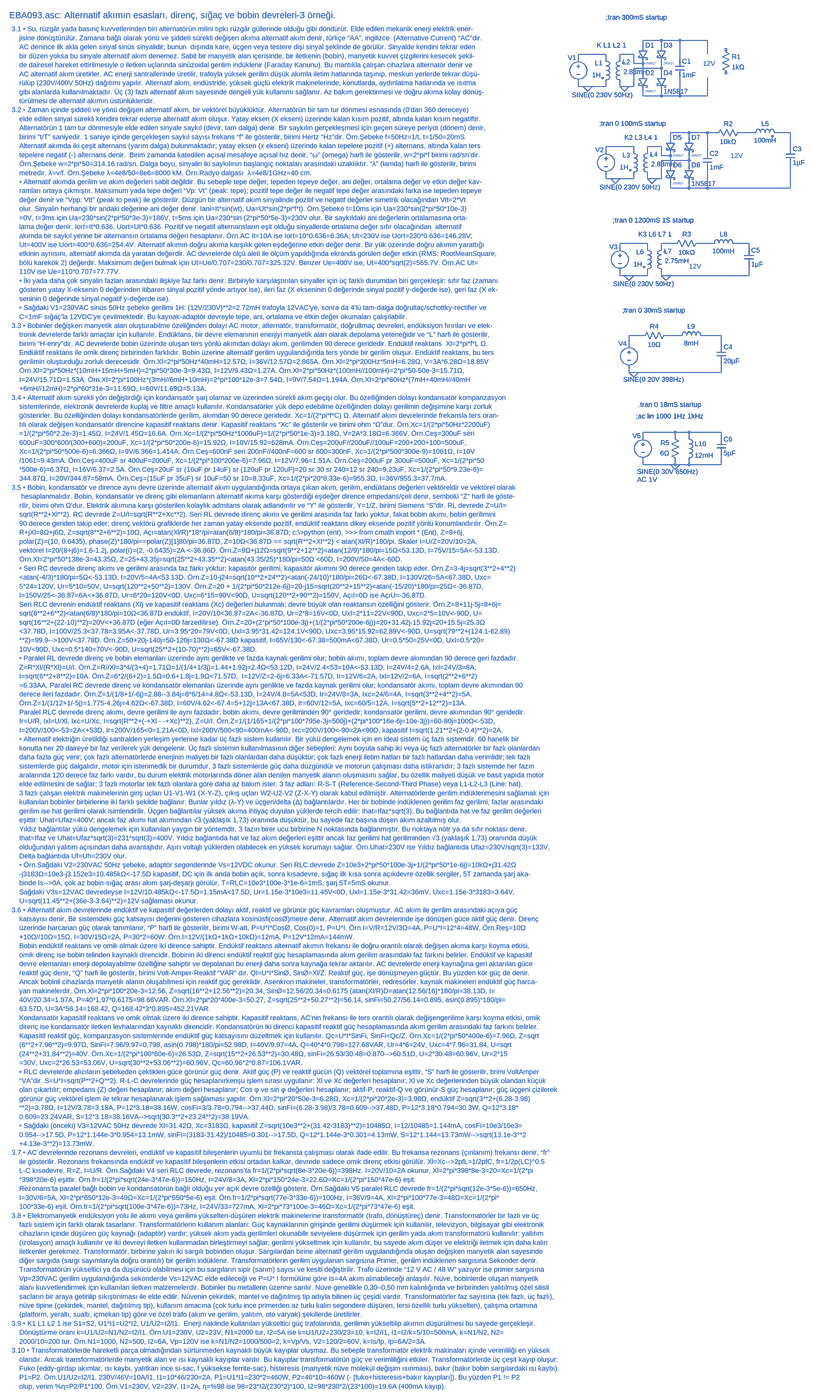
[diagram p0: schematic EBA093.asc, whole sheet]
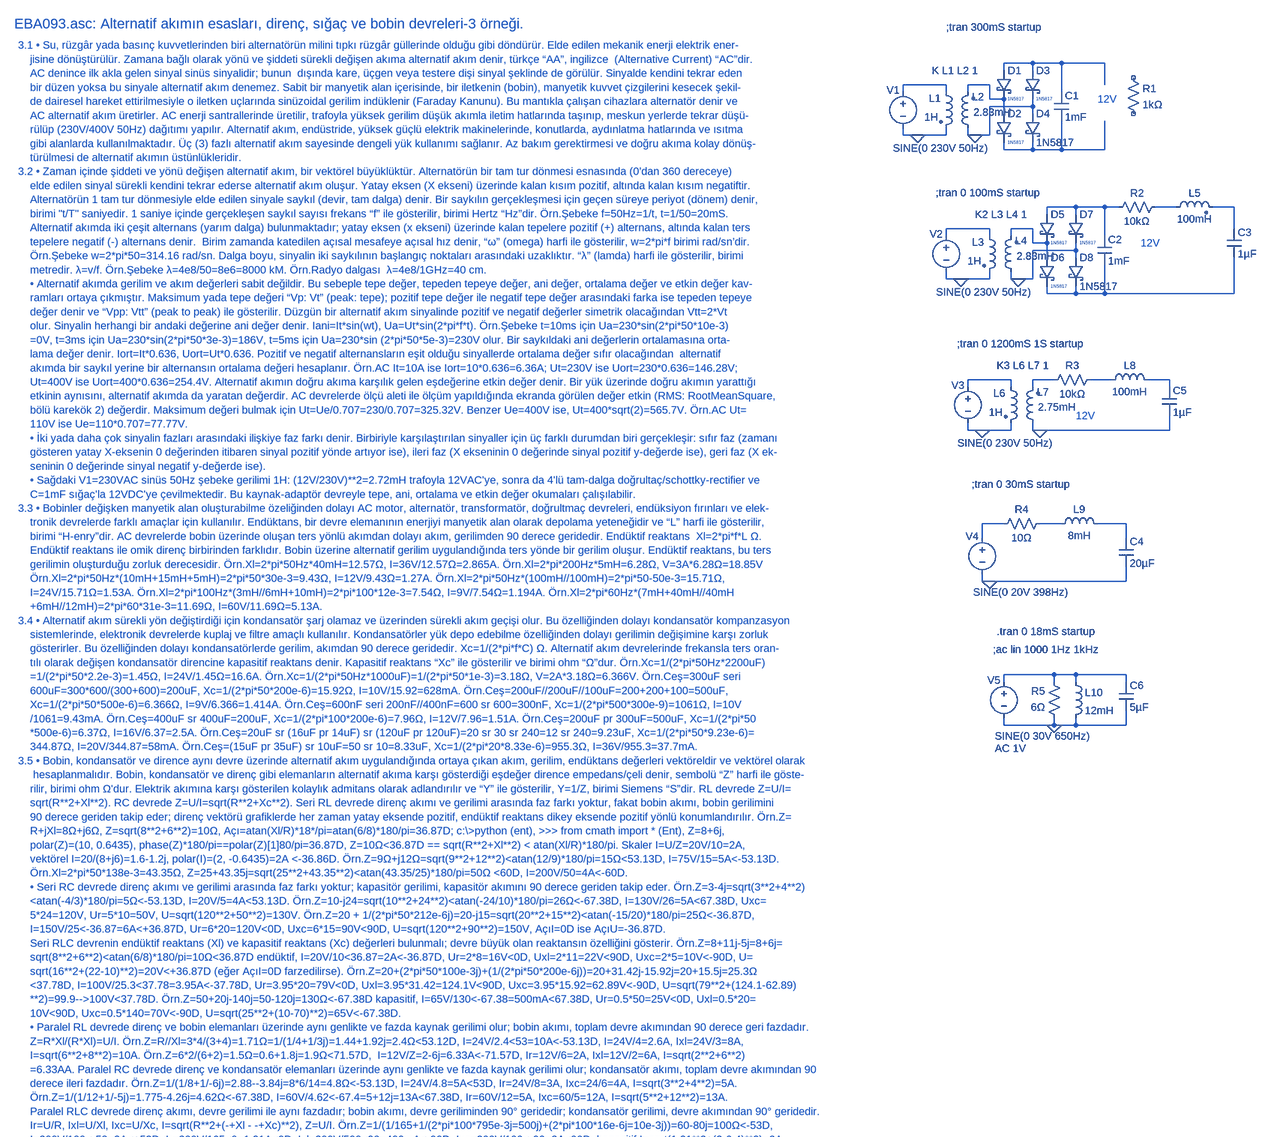
[diagram p1: schematic EBA093.asc, part, row 1 of 2, column 1 of 1]
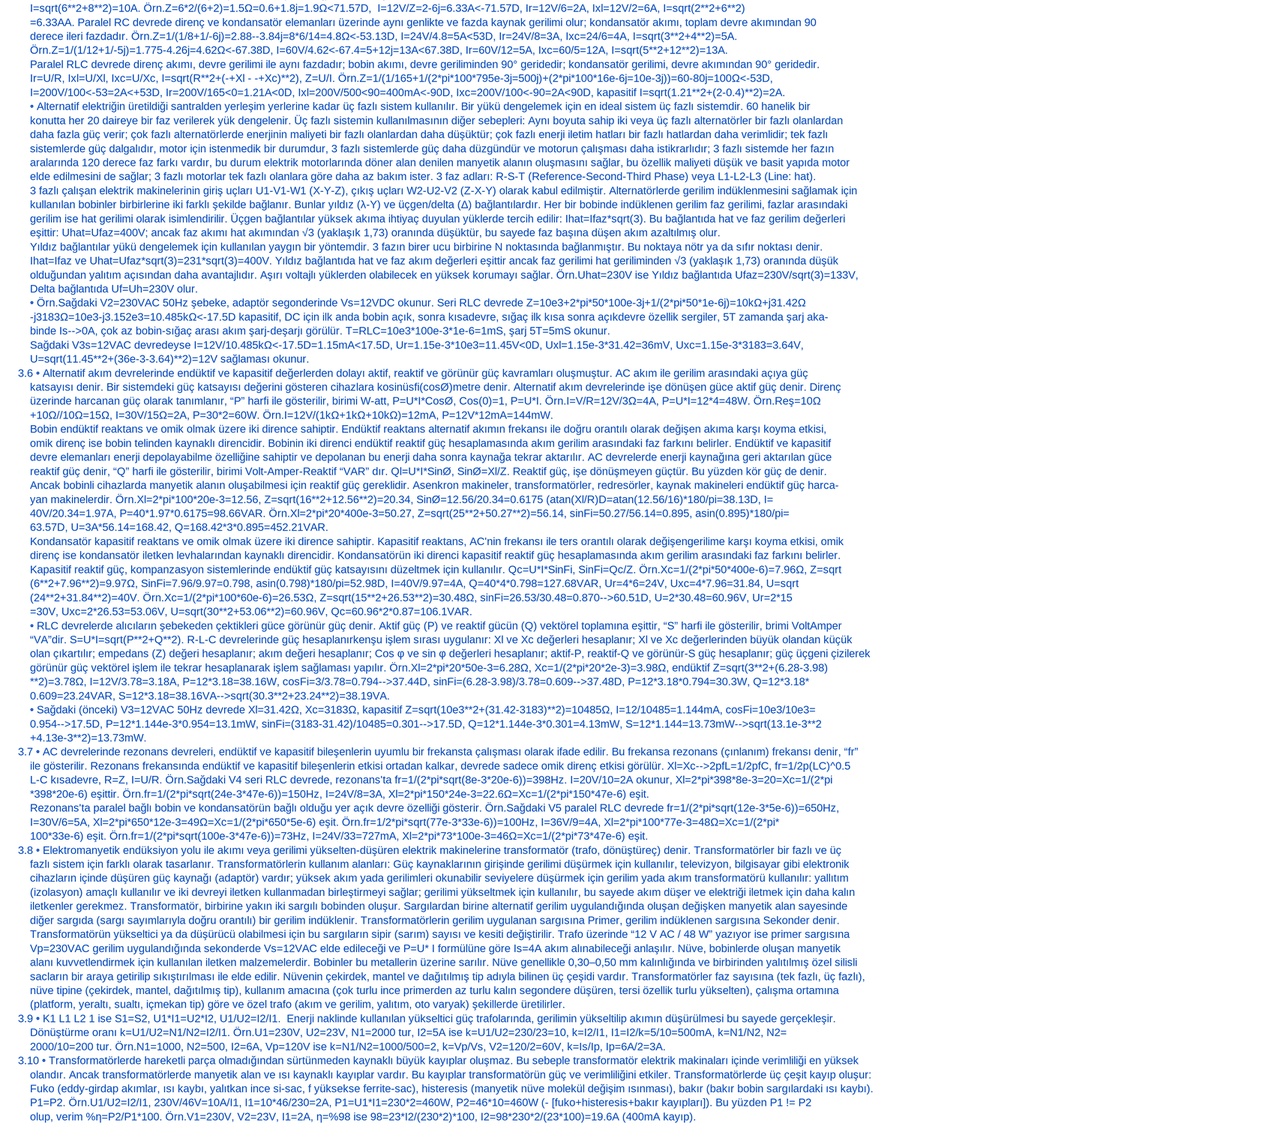
[diagram p2: schematic EBA093.asc, part, row 2 of 2, column 1 of 1]
* EBA093.asc
V1 N002 0 SINE(0 230V 50Hz)
L1 N002 0 1H Rser=10Ω
L2 0 N003 2.83mH
D1 N001 N003 1N5817
D2 N003 N004 1N5817
D3 N001 0 1N5817
D4 0 N004 1N5817
C1 N001 N004 1mF
R1 NC_01 NC_02 1kΩ
V2 N008 0 SINE(0 230V 50Hz)
L3 N008 0 1H Rser=10Ω
L4 0 N009 2.83mH
D5 N005 N009 1N5817
D6 N009 N010 1N5817
D7 N005 0 1N5817
D8 0 N010 1N5817
C2 N005 N010 1mF
R2 N006 N005 10kΩ
L5 N006 N007 100mH
C3 N007 N010 1µF
V3 N011 0 SINE(0 230V 50Hz)
L6 N011 0 1H Rser=10Ω
L7 0 N012 2.75mH
R3 N013 N012 10kΩ
L8 N013 N014 100mH
C5 N014 0 1µF
R4 N016 N015 10Ω
L9 N016 N017 8mH
C4 N017 0 20µF
V4 N015 0 SINE(0 20V 398Hz)
V5 N018 0 SINE(0 30V 650Hz) AC 1V
R5 0 N018 6Ω
L10 N018 0 12mH
C6 N018 0 5µF
.model D D
.lib standard.dio
* EBA093.asc: Alternatif akımın esasları, direnç, sığaç ve bobin devreleri-3 örneği.
* 3.1 • Su, rüzgâr yada basınç kuvvetlerinden biri alternatörün milini tıpkı rüzgâr güllerinde olduğu gibi döndürür. Elde edilen mekanik enerji elektrik ener-
*     jisine dönüştürülür. Zamana bağlı olarak yönü ve şiddeti sürekli değişen akıma alternatif akım denir, türkçe “AA”, ingilizce  (Alternative Current) “AC”dir.
*     AC denince ilk akla gelen sinyal sinüs sinyalidir; bunun  dışında kare, üçgen veya testere dişi sinyal şeklinde de görülür. Sinyalde kendini tekrar eden
*     bir düzen yoksa bu sinyale alternatif akım denemez. Sabit bir manyetik alan içerisinde, bir iletkenin (bobin), manyetik kuvvet çizgilerini kesecek şekil-
*     de dairesel hareket ettirilmesiyle o iletken uçlarında sinüzoidal gerilim indüklenir (Faraday Kanunu). Bu mantıkla çalışan cihazlara alternatör denir ve
*     AC alternatif akım üretirler. AC enerji santrallerinde üretilir, trafoyla yüksek gerilim düşük akımla iletim hatlarında taşınıp, meskun yerlerde tekrar düşü-
*     rülüp (230V/400V 50Hz) dağıtımı yapılır. Alternatif akım, endüstride, yüksek güçlü elektrik makinelerinde, konutlarda, aydınlatma hatlarında ve ısıtma
*     gibi alanlarda kullanılmaktadır. Üç (3) fazlı alternatif akım sayesinde dengeli yük kullanımı sağlanır. Az bakım gerektirmesi ve doğru akıma kolay dönüş-
*     türülmesi de alternatif akımın üstünlükleridir.
* 3.2 • Zaman içinde şiddeti ve yönü değişen alternatif akım, bir vektörel büyüklüktür. Alternatörün bir tam tur dönmesi esnasında (0’dan 360 dereceye)
*     elde edilen sinyal sürekli kendini tekrar ederse alternatif akım oluşur. Yatay eksen (X ekseni) üzerinde kalan kısım pozitif, altında kalan kısım negatiftir.
*     Alternatörün 1 tam tur dönmesiyle elde edilen sinyale saykıl (devir, tam dalga) denir. Bir saykılın gerçekleşmesi için geçen süreye periyot (dönem) denir,
*     birimi "t/T" saniyedir. 1 saniye içinde gerçekleşen saykıl sayısı frekans “f” ile gösterilir, birimi Hertz “Hz”dir. Örn.Şebeke f=50Hz=1/t, t=1/50=20mS.
*     Alternatif akımda iki çeşit alternans (yarım dalga) bulunmaktadır; yatay eksen (x ekseni) üzerinde kalan tepelere pozitif (+) alternans, altında kalan ters
*     tepelere negatif (-) alternans denir.  Birim zamanda katedilen açısal mesafeye açısal hız denir, “ω” (omega) harfi ile gösterilir, w=2*pi*f birimi rad/sn’dir.
*     Örn.Şebeke w=2*pi*50=314.16 rad/sn. Dalga boyu, sinyalin iki saykılının başlangıç noktaları arasındaki uzaklıktır. “λ” (lamda) harfi ile gösterilir, birimi
*     metredir. λ=v/f. Örn.Şebeke λ=4e8/50=8e6=8000 kM. Örn.Radyo dalgası  λ=4e8/1GHz=40 cm.
*     • Alternatif akımda gerilim ve akım değerleri sabit değildir. Bu sebeple tepe değer, tepeden tepeye değer, ani değer, ortalama değer ve etkin değer kav-
*     ramları ortaya çıkmıştır. Maksimum yada tepe değeri “Vp: Vt” (peak: tepe); pozitif tepe değer ile negatif tepe değer arasındaki farka ise tepeden tepeye
*     değer denir ve “Vpp: Vtt” (peak to peak) ile gösterilir. Düzgün bir alternatif akım sinyalinde pozitif ve negatif değerler simetrik olacağından Vtt=2*Vt
*     olur. Sinyalin herhangi bir andaki değerine ani değer denir. Iani=It*sin(wt), Ua=Ut*sin(2*pi*f*t). Örn.Şebeke t=10ms için Ua=230*sin(2*pi*50*10e-3)
*     =0V, t=3ms için Ua=230*sin(2*pi*50*3e-3)=186V, t=5ms için Ua=230*sin (2*pi*50*5e-3)=230V olur. Bir saykıldaki ani değerlerin ortalamasına orta-
*     lama değer denir. Iort=It*0.636, Uort=Ut*0.636. Pozitif ve negatif alternansların eşit olduğu sinyallerde ortalama değer sıfır olacağından  alternatif
*     akımda bir saykıl yerine bir alternansın ortalama değeri hesaplanır. Örn.AC It=10A ise Iort=10*0.636=6.36A; Ut=230V ise Uort=230*0.636=146.28V;
*     Ut=400V ise Uort=400*0.636=254.4V. Alternatif akımın doğru akıma karşılık gelen eşdeğerine etkin değer denir. Bir yük üzerinde doğru akımın yarattığı
*     etkinin aynısını, alternatif akımda da yaratan değerdir. AC devrelerde ölçü aleti ile ölçüm yapıldığında ekranda görülen değer etkin (RMS: RootMeanSquare,
*     bölü karekök 2) değerdir. Maksimum değeri bulmak için Ut=Ue/0.707=230/0.707=325.32V. Benzer Ue=400V ise, Ut=400*sqrt(2)=565.7V. Örn.AC Ut=
*     110V ise Ue=110*0.707=77.77V.
*     • İki yada daha çok sinyalin fazları arasındaki ilişkiye faz farkı denir. Birbiriyle karşılaştırılan sinyaller için üç farklı durumdan biri gerçekleşir: sıfır faz (zamanı
*     gösteren yatay X-eksenin 0 değerinden itibaren sinyal pozitif yönde artıyor ise), ileri faz (X ekseninin 0 değerinde sinyal pozitif y-değerde ise), geri faz (X ek-
*     seninin 0 değerinde sinyal negatif y-değerde ise).
*     • Sağdaki V1=230VAC sinüs 50Hz şebeke gerilimi 1H: (12V/230V)**2=2.72mH trafoyla 12VAC'ye, sonra da 4'lü tam-dalga doğrultaç/schottky-rectifier ve
*     C=1mF sığaç'la 12VDC'ye çevilmektedir. Bu kaynak-adaptör devreyle tepe, ani, ortalama ve etkin değer okumaları çalışılabilir.
* 3.3 • Bobinler değişken manyetik alan oluşturabilme özeliğinden dolayı AC motor, alternatör, transformatör, doğrultmaç devreleri, endüksiyon fırınları ve elek-
*     tronik devrelerde farklı amaçlar için kullanılır. Endüktans, bir devre elemanının enerjiyi manyetik alan olarak depolama yeteneğidir ve “L” harfi ile gösterilir,
*     birimi “H-enry”dir. AC devrelerde bobin üzerinde oluşan ters yönlü akımdan dolayı akım, gerilimden 90 derece geridedir. Endüktif reaktans  Xl=2*pi*f*L Ω.
*     Endüktif reaktans ile omik direnç birbirinden farklıdır. Bobin üzerine alternatif gerilim uygulandığında ters yönde bir gerilim oluşur. Endüktif reaktans, bu ters
*     gerilimin oluşturduğu zorluk derecesidir. Örn.Xl=2*pi*50Hz*40mH=12.57Ω, I=36V/12.57Ω=2.865A. Örn.Xl=2*pi*200Hz*5mH=6.28Ω, V=3A*6.28Ω=18.85V
*     Örn.Xl=2*pi*50Hz*(10mH+15mH+5mH)=2*pi*50*30e-3=9.43Ω, I=12V/9.43Ω=1.27A. Örn.Xl=2*pi*50Hz*(100mH//100mH)=2*pi*50-50e-3=15.71Ω,
*     I=24V/15.71Ω=1.53A. Örn.Xl=2*pi*100Hz*(3mH//6mH+10mH)=2*pi*100*12e-3=7.54Ω, I=9V/7.54Ω=1.194A. Örn.Xl=2*pi*60Hz*(7mH+40mH//40mH
*     +6mH//12mH)=2*pi*60*31e-3=11.69Ω, I=60V/11.69Ω=5.13A.
* 3.4 • Alternatif akım sürekli yön değiştirdiği için kondansatör şarj olamaz ve üzerinden sürekli akım geçişi olur. Bu özelliğinden dolayı kondansatör kompanzasyon
*     sistemlerinde, elektronik devrelerde kuplaj ve filtre amaçlı kullanılır. Kondansatörler yük depo edebilme özelliğinden dolayı gerilimin değişimine karşı zorluk
*     gösterirler. Bu özelliğinden dolayı kondansatörlerde gerilim, akımdan 90 derece geridedir. Xc=1/(2*pi*f*C) Ω. Alternatif akım devrelerinde frekansla ters oran-
*     tılı olarak değişen kondansatör direncine kapasitif reaktans denir. Kapasitif reaktans “Xc” ile gösterilir ve birimi ohm “Ω”dur. Örn.Xc=1/(2*pi*50Hz*2200uF)
*     =1/(2*pi*50*2.2e-3)=1.45Ω, I=24V/1.45Ω=16.6A. Örn.Xc=1/(2*pi*50Hz*1000uF)=1/(2*pi*50*1e-3)=3.18Ω, V=2A*3.18Ω=6.366V. Örn.Ceş=300uF seri
*     600uF=300*600/(300+600)=200uF, Xc=1/(2*pi*50*200e-6)=15.92Ω, I=10V/15.92=628mA. Örn.Ceş=200uF//200uF//100uF=200+200+100=500uF,
*     Xc=1/(2*pi*50*500e-6)=6.366Ω, I=9V/6.366=1.414A. Örn.Ceş=600nF seri 200nF//400nF=600 sr 600=300nF, Xc=1/(2*pi*500*300e-9)=1061Ω, I=10V
*     /1061=9.43mA. Örn.Ceş=400uF sr 400uF=200uF, Xc=1/(2*pi*100*200e-6)=7.96Ω, I=12V/7.96=1.51A. Örn.Ceş=200uF pr 300uF=500uF, Xc=1/(2*pi*50
*     *500e-6)=6.37Ω, I=16V/6.37=2.5A. Örn.Ceş=20uF sr (16uF pr 14uF) sr (120uF pr 120uF)=20 sr 30 sr 240=12 sr 240=9.23uF, Xc=1/(2*pi*50*9.23e-6)=
*     344.87Ω, I=20V/344.87=58mA. Örn.Ceş=(15uF pr 35uF) sr 10uF=50 sr 10=8.33uF, Xc=1/(2*pi*20*8.33e-6)=955.3Ω, I=36V/955.3=37.7mA.
* 3.5 • Bobin, kondansatör ve dirence aynı devre üzerinde alternatif akım uygulandığında ortaya çıkan akım, gerilim, endüktans değerleri vektöreldir ve vektörel olarak
*      hesaplanmalıdır. Bobin, kondansatör ve direnç gibi elemanların alternatif akıma karşı gösterdiği eşdeğer dirence empedans/çeli denir, sembolü “Z” harfi ile göste-
*     rilir, birimi ohm Ω'dur. Elektrik akımına karşı gösterilen kolaylık admitans olarak adlandırılır ve “Y” ile gösterilir, Y=1/Z, birimi Siemens “S”dir. RL devrede Z=U/I=
*     sqrt(R**2+Xl**2). RC devrede Z=U/I=sqrt(R**2+Xc**2). Seri RL devrede direnç akımı ve gerilimi arasında faz farkı yoktur, fakat bobin akımı, bobin gerilimini
*     90 derece geriden takip eder; direnç vektörü grafiklerde her zaman yatay eksende pozitif, endüktif reaktans dikey eksende pozitif yönlü konumlandırılır. Örn.Z=
*     R+jXl=8Ω+j6Ω, Z=sqrt(8**2+6**2)=10Ω, Açı=atan(Xl/R)*18*/pi=atan(6/8)*180/pi=36.87D; c:\>python (ent), >>> from cmath import * (Ent), Z=8+6j,
*     polar(Z)=(10, 0.6435), phase(Z)*180/pi==polar(Z)[1]80/pi=36.87D, Z=10Ω<36.87D == sqrt(R**2+Xl**2) < atan(Xl/R)*180/pi. Skaler I=U/Z=20V/10=2A,
*     vektörel I=20/(8+j6)=1.6-1.2j, polar(I)=(2, -0.6435)=2A <-36.86D. Örn.Z=9Ω+j12Ω=sqrt(9**2+12**2)<atan(12/9)*180/pi=15Ω<53.13D, I=75V/15=5A<-53.13D.
*     Örn.Xl=2*pi*50*138e-3=43.35Ω, Z=25+43.35j=sqrt(25**2+43.35**2)<atan(43.35/25)*180/pi=50Ω <60D, I=200V/50=4A<-60D.
*     • Seri RC devrede direnç akımı ve gerilimi arasında faz farkı yoktur; kapasitör gerilimi, kapasitör akımını 90 derece geriden takip eder. Örn.Z=3-4j=sqrt(3**2+4**2)
*     <atan(-4/3)*180/pi=5Ω<-53.13D, I=20V/5=4A<53.13D. Örn.Z=10-j24=sqrt(10**2+24**2)<atan(-24/10)*180/pi=26Ω<-67.38D, I=130V/26=5A<67.38D, Uxc=
*     5*24=120V, Ur=5*10=50V, U=sqrt(120**2+50**2)=130V. Örn.Z=20 + 1/(2*pi*50*212e-6j)=20-j15=sqrt(20**2+15**2)<atan(-15/20)*180/pi=25Ω<-36.87D,
*     I=150V/25<-36.87=6A<+36.87D, Ur=6*20=120V<0D, Uxc=6*15=90V<90D, U=sqrt(120**2+90**2)=150V, AçıI=0D ise AçıU=-36.87D.
*     Seri RLC devrenin endüktif reaktans (Xl) ve kapasitif reaktans (Xc) değerleri bulunmalı; devre büyük olan reaktansın özelliğini gösterir. Örn.Z=8+11j-5j=8+6j=
*     sqrt(8**2+6**2)<atan(6/8)*180/pi=10Ω<36.87D endüktif, I=20V/10<36.87=2A<-36.87D, Ur=2*8=16V<0D, Uxl=2*11=22V<90D, Uxc=2*5=10V<-90D, U=
*     sqrt(16**2+(22-10)**2)=20V<+36.87D (eğer AçıI=0D farzedilirse). Örn.Z=20+(2*pi*50*100e-3j)+(1/(2*pi*50*200e-6j))=20+31.42j-15.92j=20+15.5j=25.3Ω
*     <37.78D, I=100V/25.3<37.78=3.95A<-37.78D, Ur=3.95*20=79V<0D, Uxl=3.95*31.42=124.1V<90D, Uxc=3.95*15.92=62.89V<-90D, U=sqrt(79**2+(124.1-62.89)
*     **2)=99.9-->100V<37.78D. Örn.Z=50+20j-140j=50-120j=130Ω<-67.38D kapasitif, I=65V/130<-67.38=500mA<67.38D, Ur=0.5*50=25V<0D, Uxl=0.5*20=
*     10V<90D, Uxc=0.5*140=70V<-90D, U=sqrt(25**2+(10-70)**2)=65V<-67.38D.
*     • Paralel RL devrede direnç ve bobin elemanları üzerinde aynı genlikte ve fazda kaynak gerilimi olur; bobin akımı, toplam devre akımından 90 derece geri fazdadır.
*     Z=R*Xl/(R*Xl)=U/I. Örn.Z=R//Xl=3*4/(3+4)=1.71Ω=1/(1/4+1/3j)=1.44+1.92j=2.4Ω<53.12D, I=24V/2.4<53=10A<-53.13D, I=24V/4=2.6A, Ixl=24V/3=8A,
*     I=sqrt(6**2+8**2)=10A. Örn.Z=6*2/(6+2)=1.5Ω=0.6+1.8j=1.9Ω<71.57D,  I=12V/Z=2-6j=6.33A<-71.57D, Ir=12V/6=2A, Ixl=12V/2=6A, I=sqrt(2**2+6**2)
*     =6.33AA. Paralel RC devrede direnç ve kondansatör elemanları üzerinde aynı genlikte ve fazda kaynak gerilimi olur; kondansatör akımı, toplam devre akımından 90
*     derece ileri fazdadır. Örn.Z=1/(1/8+1/-6j)=2.88--3.84j=8*6/14=4.8Ω<-53.13D, I=24V/4.8=5A<53D, Ir=24V/8=3A, Ixc=24/6=4A, I=sqrt(3**2+4**2)=5A.
*     Örn.Z=1/(1/12+1/-5j)=1.775-4.26j=4.62Ω<-67.38D, I=60V/4.62<-67.4=5+12j=13A<67.38D, Ir=60V/12=5A, Ixc=60/5=12A, I=sqrt(5**2+12**2)=13A.
*     Paralel RLC devrede direnç akımı, devre gerilimi ile aynı fazdadır; bobin akımı, devre geriliminden 90° geridedir; kondansatör gerilimi, devre akımından 90° geridedir.
*     Ir=U/R, Ixl=U/Xl, Ixc=U/Xc, I=sqrt(R**2+(-+Xl - -+Xc)**2), Z=U/I. Örn.Z=1/(1/165+1/(2*pi*100*795e-3j=500j)+(2*pi*100*16e-6j=10e-3j))=60-80j=100Ω<-53D,
*     I=200V/100<-53=2A<+53D, Ir=200V/165<0=1.21A<0D, Ixl=200V/500<90=400mA<-90D, Ixc=200V/100<-90=2A<90D, kapasitif I=sqrt(1.21**2+(2-0.4)**2)=2A.
*     • Alternatif elektriğin üretildiği santralden yerleşim yerlerine kadar üç fazlı sistem kullanılır. Bir yükü dengelemek için en ideal sistem üç fazlı sistemdir. 60 hanelik bir
*     konutta her 20 daireye bir faz verilerek yük dengelenir. Üç fazlı sistemin kullanılmasının diğer sebepleri: Aynı boyuta sahip iki veya üç fazlı alternatörler bir fazlı olanlardan
*     daha fazla güç verir; çok fazlı alternatörlerde enerjinin maliyeti bir fazlı olanlardan daha düşüktür; çok fazlı enerji iletim hatları bir fazlı hatlardan daha verimlidir; tek fazlı
*     sistemlerde güç dalgalıdır, motor için istenmedik bir durumdur, 3 fazlı sistemlerde güç daha düzgündür ve motorun çalışması daha istikrarlıdır; 3 fazlı sistemde her fazın
*     aralarında 120 derece faz farkı vardır, bu durum elektrik motorlarında döner alan denilen manyetik alanın oluşmasını sağlar, bu özellik maliyeti düşük ve basit yapıda motor
*     elde edilmesini de sağlar; 3 fazlı motorlar tek fazlı olanlara göre daha az bakım ister. 3 faz adları: R-S-T (Reference-Second-Third Phase) veya L1-L2-L3 (Line: hat).
*     3 fazlı çalışan elektrik makinelerinin giriş uçları U1-V1-W1 (X-Y-Z), çıkış uçları W2-U2-V2 (Z-X-Y) olarak kabul edilmiştir. Alternatörlerde gerilim indüklenmesini sağlamak için
*     kullanılan bobinler birbirlerine iki farklı şekilde bağlanır. Bunlar yıldız (λ-Y) ve üçgen/delta (Δ) bağlantılardır. Her bir bobinde indüklenen gerilim faz gerilimi, fazlar arasındaki
*     gerilim ise hat gerilimi olarak isimlendirilir. Üçgen bağlantılar yüksek akıma ihtiyaç duyulan yüklerde tercih edilir: Ihat=Ifaz*sqrt(3). Bu bağlantıda hat ve faz gerilim değerleri
*     eşittir: Uhat=Ufaz=400V; ancak faz akımı hat akımından √3 (yaklaşık 1,73) oranında düşüktür, bu sayede faz başına düşen akım azaltılmış olur.
*     Yıldız bağlantılar yükü dengelemek için kullanılan yaygın bir yöntemdir. 3 fazın birer ucu birbirine N noktasında bağlanmıştır. Bu noktaya nötr ya da sıfır noktası denir.
*     Ihat=Ifaz ve Uhat=Ufaz*sqrt(3)=231*sqrt(3)=400V. Yıldız bağlantıda hat ve faz akım değerleri eşittir ancak faz gerilimi hat geriliminden √3 (yaklaşık 1,73) oranında düşük
*     olduğundan yalıtım açısından daha avantajlıdır. Aşırı voltajlı yüklerden olabilecek en yüksek korumayı sağlar. Örn.Uhat=230V ise Yıldız bağlantıda Ufaz=230V/sqrt(3)=133V,
*     Delta bağlantıda Uf=Uh=230V olur.
*     • Örn.Sağdaki V2=230VAC 50Hz şebeke, adaptör segonderinde Vs=12VDC okunur. Seri RLC devrede Z=10e3+2*pi*50*100e-3j+1/(2*pi*50*1e-6j)=10kΩ+j31.42Ω
*     -j3183Ω=10e3-j3.152e3=10.485kΩ<-17.5D kapasitif, DC için ilk anda bobin açık, sonra kısadevre, sığaç ilk kısa sonra açıkdevre özellik sergiler, 5T zamanda şarj aka-
*     binde Is-->0A, çok az bobin-sığaç arası akım şarj-deşarjı görülür. T=RLC=10e3*100e-3*1e-6=1mS, şarj 5T=5mS okunur.
*     Sağdaki V3s=12VAC devredeyse I=12V/10.485kΩ<-17.5D=1.15mA<17.5D, Ur=1.15e-3*10e3=11.45V<0D, Uxl=1.15e-3*31.42=36mV, Uxc=1.15e-3*3183=3.64V,
*     U=sqrt(11.45**2+(36e-3-3.64)**2)=12V sağlaması okunur.
* 3.6 • Alternatif akım devrelerinde endüktif ve kapasitif değerlerden dolayı aktif, reaktif ve görünür güç kavramları oluşmuştur. AC akım ile gerilim arasındaki açıya güç
*     katsayısı denir. Bir sistemdeki güç katsayısı değerini gösteren cihazlara kosinüsfi(cosØ)metre denir. Alternatif akım devrelerinde işe dönüşen güce aktif güç denir. Direnç
*     üzerinde harcanan güç olarak tanımlanır, “P” harfi ile gösterilir, birimi W-att, P=U*I*CosØ, Cos(0)=1, P=U*I. Örn.I=V/R=12V/3Ω=4A, P=U*I=12*4=48W. Örn.Reş=10Ω
*     +10Ω//10Ω=15Ω, I=30V/15Ω=2A, P=30*2=60W. Örn.I=12V/(1kΩ+1kΩ+10kΩ)=12mA, P=12V*12mA=144mW.
*     Bobin endüktif reaktans ve omik olmak üzere iki dirence sahiptir. Endüktif reaktans alternatif akımın frekansı ile doğru orantılı olarak değişen akıma karşı koyma etkisi,
*     omik direnç ise bobin telinden kaynaklı direncidir. Bobinin iki direnci endüktif reaktif güç hesaplamasında akım gerilim arasındaki faz farkını belirler. Endüktif ve kapasitif
*     devre elemanları enerji depolayabilme özelliğine sahiptir ve depolanan bu enerji daha sonra kaynağa tekrar aktarılır. AC devrelerde enerji kaynağına geri aktarılan güce
*     reaktif güç denir, “Q” harfi ile gösterilir, birimi Volt-Amper-Reaktif “VAR” dır. Ql=U*I*SinØ, SinØ=Xl/Z. Reaktif güç, işe dönüşmeyen güçtür. Bu yüzden kör güç de denir.
*     Ancak bobinli cihazlarda manyetik alanın oluşabilmesi için reaktif güç gereklidir. Asenkron makineler, transformatörler, redresörler, kaynak makineleri endüktif güç harca-
*     yan makinelerdir. Örn.Xl=2*pi*100*20e-3=12.56, Z=sqrt(16**2+12.56**2)=20.34, SinØ=12.56/20.34=0.6175 (atan(Xl/R)D=atan(12.56/16)*180/pi=38.13D, I=
*     40V/20.34=1.97A, P=40*1.97*0.6175=98.66VAR. Örn.Xl=2*pi*20*400e-3=50.27, Z=sqrt(25**2+50.27**2)=56.14, sinFi=50.27/56.14=0.895, asin(0.895)*180/pi=
*     63.57D, U=3A*56.14=168.42, Q=168.42*3*0.895=452.21VAR.
*     Kondansatör kapasitif reaktans ve omik olmak üzere iki dirence sahiptir. Kapasitif reaktans, AC'nin frekansı ile ters orantılı olarak değişengerilime karşı koyma etkisi, omik
*     direnç ise kondansatör iletken levhalarından kaynaklı direncidir. Kondansatörün iki direnci kapasitif reaktif güç hesaplamasında akım gerilim arasındaki faz farkını belirler.
*     Kapasitif reaktif güç, kompanzasyon sistemlerinde endüktif güç katsayısını düzeltmek için kullanılır. Qc=U*I*SinFi, SinFi=Qc/Z. Örn.Xc=1/(2*pi*50*400e-6)=7.96Ω, Z=sqrt
*     (6**2+7.96**2)=9.97Ω, SinFi=7.96/9.97=0.798, asin(0.798)*180/pi=52.98D, I=40V/9.97=4A, Q=40*4*0.798=127.68VAR, Ur=4*6=24V, Uxc=4*7.96=31.84, U=sqrt
*     (24**2+31.84**2)=40V. Örn.Xc=1/(2*pi*100*60e-6)=26.53Ω, Z=sqrt(15**2+26.53**2)=30.48Ω, sinFi=26.53/30.48=0.870-->60.51D, U=2*30.48=60.96V, Ur=2*15
*     =30V, Uxc=2*26.53=53.06V, U=sqrt(30**2+53.06**2)=60.96V, Qc=60.96*2*0.87=106.1VAR.
*     • RLC devrelerde alıcıların şebekeden çektikleri güce görünür güç denir. Aktif güç (P) ve reaktif gücün (Q) vektörel toplamına eşittir, “S” harfi ile gösterilir, brimi VoltAmper
*     “VA”dir. S=U*I=sqrt(P**2+Q**2). R-L-C devrelerinde güç hesaplanırkenşu işlem sırası uygulanır: Xl ve Xc değerleri hesaplanır; Xl ve Xc değerlerinden büyük olandan küçük
*     olan çıkartılır; empedans (Z) değeri hesaplanır; akım değeri hesaplanır; Cos φ ve sin φ değerleri hesaplanır; aktif-P, reaktif-Q ve görünür-S güç hesaplanır; güç üçgeni çizilerek
*     görünür güç vektörel işlem ile tekrar hesaplanarak işlem sağlaması yapılır. Örn.Xl=2*pi*20*50e-3=6.28Ω, Xc=1/(2*pi*20*2e-3)=3.98Ω, endüktif Z=sqrt(3**2+(6.28-3.98)
*     **2)=3.78Ω, I=12V/3.78=3.18A, P=12*3.18=38.16W, cosFi=3/3.78=0.794-->37.44D, sinFi=(6.28-3.98)/3.78=0.609-->37.48D, P=12*3.18*0.794=30.3W, Q=12*3.18*
*     0.609=23.24VAR, S=12*3.18=38.16VA-->sqrt(30.3**2+23.24**2)=38.19VA.
*     • Sağdaki (önceki) V3=12VAC 50Hz devrede Xl=31.42Ω, Xc=3183Ω, kapasitif Z=sqrt(10e3**2+(31.42-3183)**2)=10485Ω, I=12/10485=1.144mA, cosFi=10e3/10e3=
*     0.954-->17.5D, P=12*1.144e-3*0.954=13.1mW, sinFi=(3183-31.42)/10485=0.301-->17.5D, Q=12*1.144e-3*0.301=4.13mW, S=12*1.144=13.73mW-->sqrt(13.1e-3**2
*     +4.13e-3**2)=13.73mW.
* 3.7 • AC devrelerinde rezonans devreleri, endüktif ve kapasitif bileşenlerin uyumlu bir frekansta çalışması olarak ifade edilir. Bu frekansa rezonans (çınlanım) frekansı denir, “fr”
*     ile gösterilir. Rezonans frekansında endüktif ve kapasitif bileşenlerin etkisi ortadan kalkar, devrede sadece omik direnç etkisi görülür. Xl=Xc-->2pfL=1/2pfC, fr=1/2p(LC)^0.5
*     L-C kısadevre, R=Z, I=U/R. Örn.Sağdaki V4 seri RLC devrede, rezonans'ta fr=1/(2*pi*sqrt(8e-3*20e-6))=398Hz. I=20V/10=2A okunur, Xl=2*pi*398*8e-3=20=Xc=1/(2*pi
*     *398*20e-6) eşittir. Örn.fr=1/(2*pi*sqrt(24e-3*47e-6))=150Hz, I=24V/8=3A, Xl=2*pi*150*24e-3=22.6Ω=Xc=1/(2*pi*150*47e-6) eşit.
*     Rezonans'ta paralel bağlı bobin ve kondansatörün bağlı olduğu yer açık devre özelliği gösterir. Örn.Sağdaki V5 paralel RLC devrede fr=1/(2*pi*sqrt(12e-3*5e-6))=650Hz,
*     I=30V/6=5A, Xl=2*pi*650*12e-3=49Ω=Xc=1/(2*pi*650*5e-6) eşit. Örn.fr=1/2*pi*sqrt(77e-3*33e-6))=100Hz, I=36V/9=4A, Xl=2*pi*100*77e-3=48Ω=Xc=1/(2*pi*
*     100*33e-6) eşit. Örn.fr=1/(2*pi*sqrt(100e-3*47e-6))=73Hz, I=24V/33=727mA, Xl=2*pi*73*100e-3=46Ω=Xc=1/(2*pi*73*47e-6) eşit.
* 3.8 • Elektromanyetik endüksiyon yolu ile akımı veya gerilimi yükselten-düşüren elektrik makinelerine transformatör (trafo, dönüştüreç) denir. Transformatörler bir fazlı ve üç
*     fazlı sistem için farklı olarak tasarlanır. Transformatörlerin kullanım alanları: Güç kaynaklarının girişinde gerilimi düşürmek için kullanılır, televizyon, bilgisayar gibi elektronik
*     cihazların içinde düşüren güç kaynağı (adaptör) vardır; yüksek akım yada gerilimleri okunabilir seviyelere düşürmek için gerilim yada akım transformatörü kullanılır: yallıtım
*     (izolasyon) amaçlı kullanılır ve iki devreyi iletken kullanmadan birleştirmeyi sağlar; gerilimi yükseltmek için kullanılır, bu sayede akım düşer ve elektriği iletmek için daha kalın
*     iletkenler gerekmez. Transformatör, birbirine yakın iki sargılı bobinden oluşur. Sargılardan birine alternatif gerilim uygulandığında oluşan değişken manyetik alan sayesinde
*     diğer sargıda (sargı sayımlarıyla doğru orantılı) bir gerilim indüklenir. Transformatörlerin gerilim uygulanan sargısına Primer, gerilim indüklenen sargısına Sekonder denir.
*     Transformatörün yükseltici ya da düşürücü olabilmesi için bu sargıların sipir (sarım) sayısı ve kesiti değiştirilir. Trafo üzerinde “12 V AC / 48 W” yazıyor ise primer sargısına
*     Vp=230VAC gerilim uygulandığında sekonderde Vs=12VAC elde edileceği ve P=U* I formülüne göre Is=4A akım alınabileceği anlaşılır. Nüve, bobinlerde oluşan manyetik
*     alanı kuvvetlendirmek için kullanılan iletken malzemelerdir. Bobinler bu metallerin üzerine sarılır. Nüve genellikle 0,30–0,50 mm kalınlığında ve birbirinden yalıtılmış özel silisli
*     sacların bir araya getirilip sıkıştırılması ile elde edilir. Nüvenin çekirdek, mantel ve dağıtılmış tip adıyla bilinen üç çeşidi vardır. Transformatörler faz sayısına (tek fazlı, üç fazlı),
*     nüve tipine (çekirdek, mantel, dağıtılmış tip), kullanım amacına (çok turlu ince primerden az turlu kalın segondere düşüren, tersi özellik turlu yükselten), çalışma ortamına
*     (platform, yeraltı, sualtı, içmekan tip) göre ve özel trafo (akım ve gerilim, yalıtım, oto varyak) şekillerde üretilirler.
* 3.9 • K1 L1 L2 1 ise S1=S2, U1*I1=U2*I2, U1/U2=I2/I1.  Enerji naklinde kullanılan yükseltici güç trafolarında, gerilimin yükseltilip akımın düşürülmesi bu sayede gerçekleşir.
*     Dönüştürme oranı k=U1/U2=N1/N2=I2/I1. Örn.U1=230V, U2=23V, N1=2000 tur, I2=5A ise k=U1/U2=230/23=10, k=I2/I1, I1=I2/k=5/10=500mA, k=N1/N2, N2=
*     2000/10=200 tur. Örn.N1=1000, N2=500, I2=6A, Vp=120V ise k=N1/N2=1000/500=2, k=Vp/Vs, V2=120/2=60V, k=Is/Ip, Ip=6A/2=3A.
* 3.10 • Transformatörlerde hareketli parça olmadığından sürtünmeden kaynaklı büyük kayıplar oluşmaz. Bu sebeple transformatör elektrik makinaları içinde verimliliği en yüksek
*     olandır. Ancak transformatörlerde manyetik alan ve ısı kaynaklı kayıplar vardır. Bu kayıplar transformatörün güç ve verimliliğini etkiler. Transformatörlerde üç çeşit kayıp oluşur:
*     Fuko (eddy-girdap akımlar, ısı kaybı, yalıtkan ince si-sac, f yüksekse ferrite-sac), histeresis (manyetik nüve molekül değişim ısınması), bakır (bakır bobin sargılardaki ısı kaybı).
*     P1=P2. Örn.U1/U2=I2/I1, 230V/46V=10A/I1, I1=10*46/230=2A, P1=U1*I1=230*2=460W, P2=46*10=460W (- [fuko+histeresis+bakır kayıpları]). Bu yüzden P1 != P2
*     olup, verim %ƞ=P2/P1*100. Örn.V1=230V, V2=23V, I1=2A, ƞ=%98 ise 98=23*I2/(230*2)*100, I2=98*230*2/(23*100)=19.6A (400mA kayıp).
;tran 300mS startup
K L1 L2 1
* 12V
K2 L3 L4 1
* 12V
;tran 0 100mS startup
K3 L6 L7 1
* 12V
;tran 0 1200mS 1S startup
;ac lin 1000 1Hz 1kHz
;tran 0 30mS startup
.tran 0 18mS startup
.backanno
.end